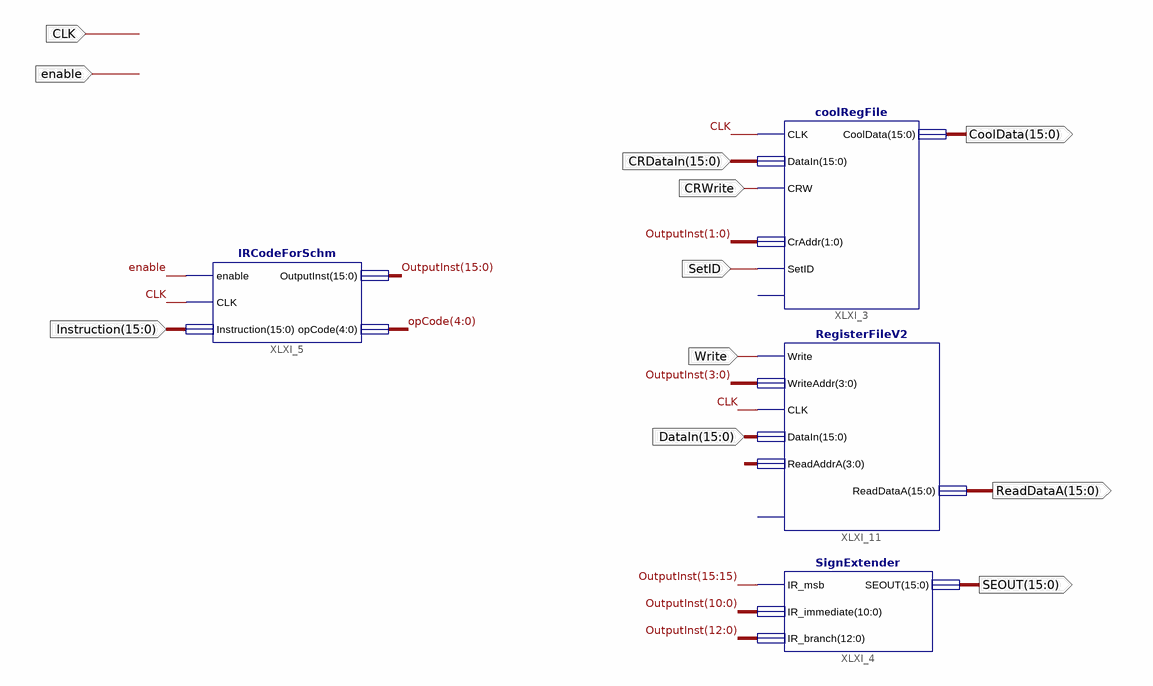
[diagram p0: schematic sheet 1]
// Xilinx ISE schematic PCAddrIRSchm.sch (spartan3e) as structural Verilog: 4 symbols, 11 ports
module PCAddrIRSchm (
  input  CLK,
  input  enable,
  input  [15:0] Instruction,
  input  [15:0] CRDataIn,
  input  SetID,
  input  Write,
  input  CRWrite,
  input  [15:0] DataIn,
  output [15:0] CoolData,
  output [15:0] ReadDataA,
  output [15:0] SEOUT
);

  wire [3:0] XLXN_24;
  wire [4:0] opCode;
  wire [15:0] OutputInst;

  SignExtender XLXI_4 (
    .IR_msb(OutputInst[15]), .IR_immediate(OutputInst[10:0]), .IR_branch(OutputInst[12:0]), .SEOUT(SEOUT));
  IRCodeForSchm XLXI_5 (
    .enable(enable), .CLK(CLK), .Instruction(Instruction), .OutputInst(OutputInst), .opCode(opCode));
  coolRegFile XLXI_3 (
    .CLK(CLK), .DataIn(CRDataIn), .CRW(CRWrite), .CrAddr(OutputInst[1:0]), .SetID(SetID), .CoolData(CoolData));  // open: Reset
  RegisterFileV2 XLXI_11 (
    .Write(Write), .WriteAddr(OutputInst[3:0]), .CLK(CLK), .DataIn(DataIn), .ReadAddrA(XLXN_24),
    .ReadDataA(ReadDataA));  // open: Reset
endmodule
